# EAGLE design variator 380V (EAGLE 6.1)
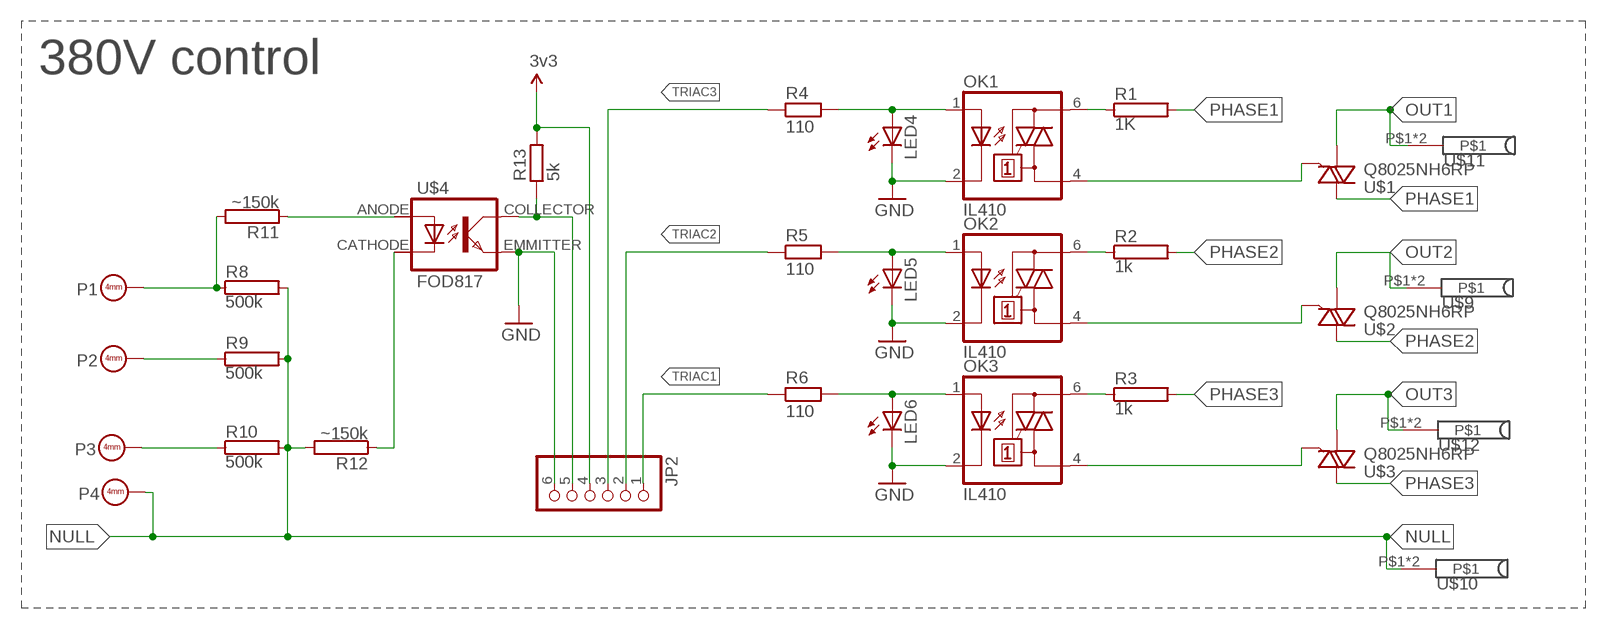
[diagram p0: schematic, sheet 1]

## Parts
JP2  PINHD-1X6/90  [1X06/90]
LED4  LED5MM  [LED5MM]
LED5  LED5MM  [LED5MM]
LED6  LED5MM  [LED5MM]
OK1  IL410  [DIL06]
OK2  IL410  [DIL06]
OK3  IL410  [DIL06]
P1  BANANA  [BANANA]
P2  BANANA  [BANANA]
P3  BANANA  [BANANA]
P4  BANANA  [BANANA]
R1  1K  RHPS58  [HPS58]
R2  1k  RHPS58  [HPS58]
R3  1k  RHPS58  [HPS58]
R4  110  R1206  [1206]
R5  110  R1206  [1206]
R6  110  R1206  [1206]
R8  500k  RAC01  [AC01]
R9  500k  RAC01  [AC01]
R10  500k  RAC01  [AC01]
R11  ~150k  RHPS58  [HPS58]
R12  ~150k  RHPS58  [HPS58]
R13  5k  R1206  [1206]
U$1  Q8025NH6RP  [TO-263]
U$2  Q8025NH6RP  [TO-263]
U$3  Q8025NH6RP  [TO-263]
U$4  FOD817  [FOD_4PIN]
U$9  BANANA  [BANANA]
U$10  BANANA  [BANANA]
U$11  BANANA  [BANANA]
U$12  BANANA  [BANANA]

## Nets
3V3: JP2.4 R13.2 ; supply symbol labelled 3v3
GND: JP2.6 LED4.K(C) LED5.K(C) LED6.K(C) OK1.2(C) OK2.2(C) OK3.2(C) U$4.EMMITTER(EMIT)
N$1: OK2.4(A1) U$2.G
N$2: OK1.4(A1) U$1.G
N$3: OK3.4(A1) U$3.G
N$4: OK1.6(A2) R1.1
N$5: OK2.6(A2) R2.1
N$6: OK3.6(A2) R3.1
N$7: LED4.A OK1.1(A) R4.2
N$10: LED5.A OK2.1(A) R5.2
N$11: LED6.A OK3.1(A) R6.2
N$14: R12.1 U$4.CATHODE
N$15: R11.1 U$4.ANODE
N$16: JP2.5 R13.1 U$4.COLLECTOR(COL)
NULL: P4.P$1 R8.2 R9.2 R10.2 R12.2 U$10.P$1 U$10.P$2
OUT1: U$1.T1 U$11.P$1 U$11.P$2
OUT2: U$2.T1 U$9.P$1 U$9.P$2
OUT3: U$3.T1 U$12.P$1 U$12.P$2
PHASE1: P1.P$1 R1.2 R8.1 R11.2 U$1.T2
PHASE2: P2.P$1 R2.2 R9.1 U$2.T2
PHASE3: P3.P$1 R3.2 R10.1 U$3.T2
TRIAC1: JP2.1 R6.1
TRIAC2: JP2.2 R5.1
TRIAC3: JP2.3 R4.1

## Notes on the sheet
- 380V control

## Library data of the parts
JP2 = pinhead:PINHD-1X6: PIN HEADER
LED4-LED6 = led:LED: LED OSRAM: - CHIPLED LG R971, LG N971, LY N971, LG Q971, LY Q971, LO R971, LY R971 LH N974, LH R974 LS Q976, LO Q976, LY Q976 LO Q996 - Hyper CHIPLED LW Q18S LB Q993, LB Q99A, LB R99A - SideLED LS A670, LO A670, LY A670, LG A670, LP A670 LB A673, LV A673, LT A673, LW A673 LH A674 LY A675 LS A676, LA A676, LO A676, LY A676, LW A676 LS A679, LY A679, LG A679 - Hyper Micro SIDELED® LS Y876, LA Y876, LO Y876, LY Y876 LT Y87S - SmartLED LW L88C, LW L88S LB L89C, LB L89S, LG L890 LS L89K, LO L89K, LY L89K LS L896, LA L896, LO L896, LY L896 - TOPLED LS T670, LO T670, LY T670, LG T670, LP T670 LSG T670, LSP T670, LSY T670, LOP T670, LYG T670 LG T671, LOG T671, LSG T671 LB T673, LV T673, LT T673, LW T673 LH T674 LS T676, LA T676, LO T676, LY T676, LB T676, LH T676, LSB T676, LW T676 LB T67C, LV T67C, LT T67C, LS T67K, LO T67K, LY T67K, LW E67C LS E67B, LA E67B, LO E67B, LY E67B, LB E67C, LV E67C, LT E67C LW T67C LS T679, LY T679, LG T679 LS T770, LO T770, LY T770, LG T770, LP T770 LB T773, LV T773, LT T773, LW T773 LH T774 LS E675, LA E675, LY E675, LS T675 LS T776, LA T776, LO T776, LY T776, LB T776 LHGB T686 LT T68C, LB T68C - Hyper Mini TOPLED® LB M676 - Mini TOPLED Santana® LG M470 LS M47K, LO M47K, LY M47K Source: http://www.osram.convergy.de LUXEON: - LUMILED® LXK2-PW12-R00, LXK2-PW12-S00, LXK2-PW14-U00, LXK2-PW14-V00 LXK2-PM12-R00, LXK2-PM12-S00, LXK2-PM14-U00 LXK2-PE12-Q00, LXK2-PE12-R00, LXK2-PE12-S00, LXK2-PE14-T00, LXK2-PE14-U00 LXK2-PB12-K00, LXK2-PB12-L00, LXK2-PB12-M00, LXK2-PB14-N00, LXK2-PB14-P00, LXK2-PB14-Q00 LXK2-PR12-L00, LXK2-PR12-M00, LXK2-PR14-Q00, LXK2-PR14-R00 LXK2-PD12-Q00, LXK2-PD12-R00, LXK2-PD12-S00 LXK2-PH12-R00, LXK2-PH12-S00 LXK2-PL12-P00, LXK2-PL12-Q00, LXK2-PL12-R00 Source: www.luxeon.com KINGBRIGHT: KA-3528ASYC Source: www.kingbright.com
OK1-OK3 = optocoupler:IL410: SIEMENS OPTO COUPLER; MF: VISHAY/TELEFUNKEN; MPN: IL410; OC_FARNELL: 1045434; OC_NEWARK: 58K1715
P1-P4 = adi_v1.4:BANANA
R1-R3 R8-R12 = resistor-power:R: Power Resitor; OC_FARNELL: unknown; OC_NEWARK: unknown
R4-R6 R13 = adi_v1.4:R
U$1-U$3 = Serghei IR station:Q8025NH6RP
U$4 = Serghei IR station:FOD817
U$9-U$12 = H_bridge_library:BANANA

## Board
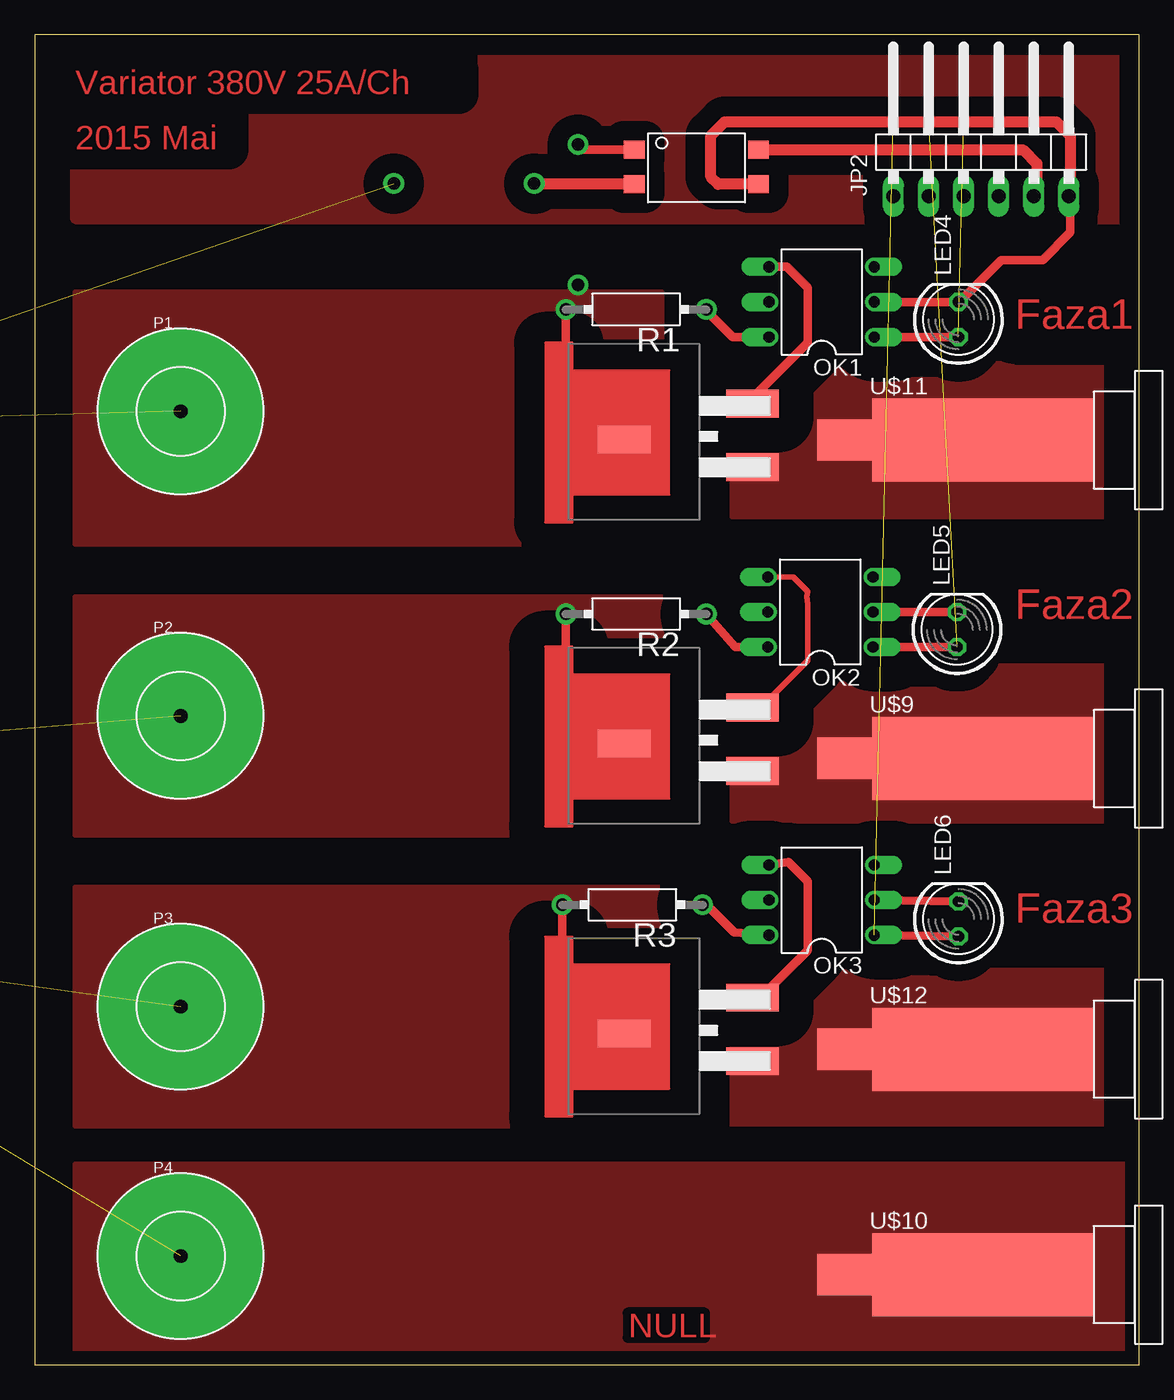
[diagram p1: board, top side]
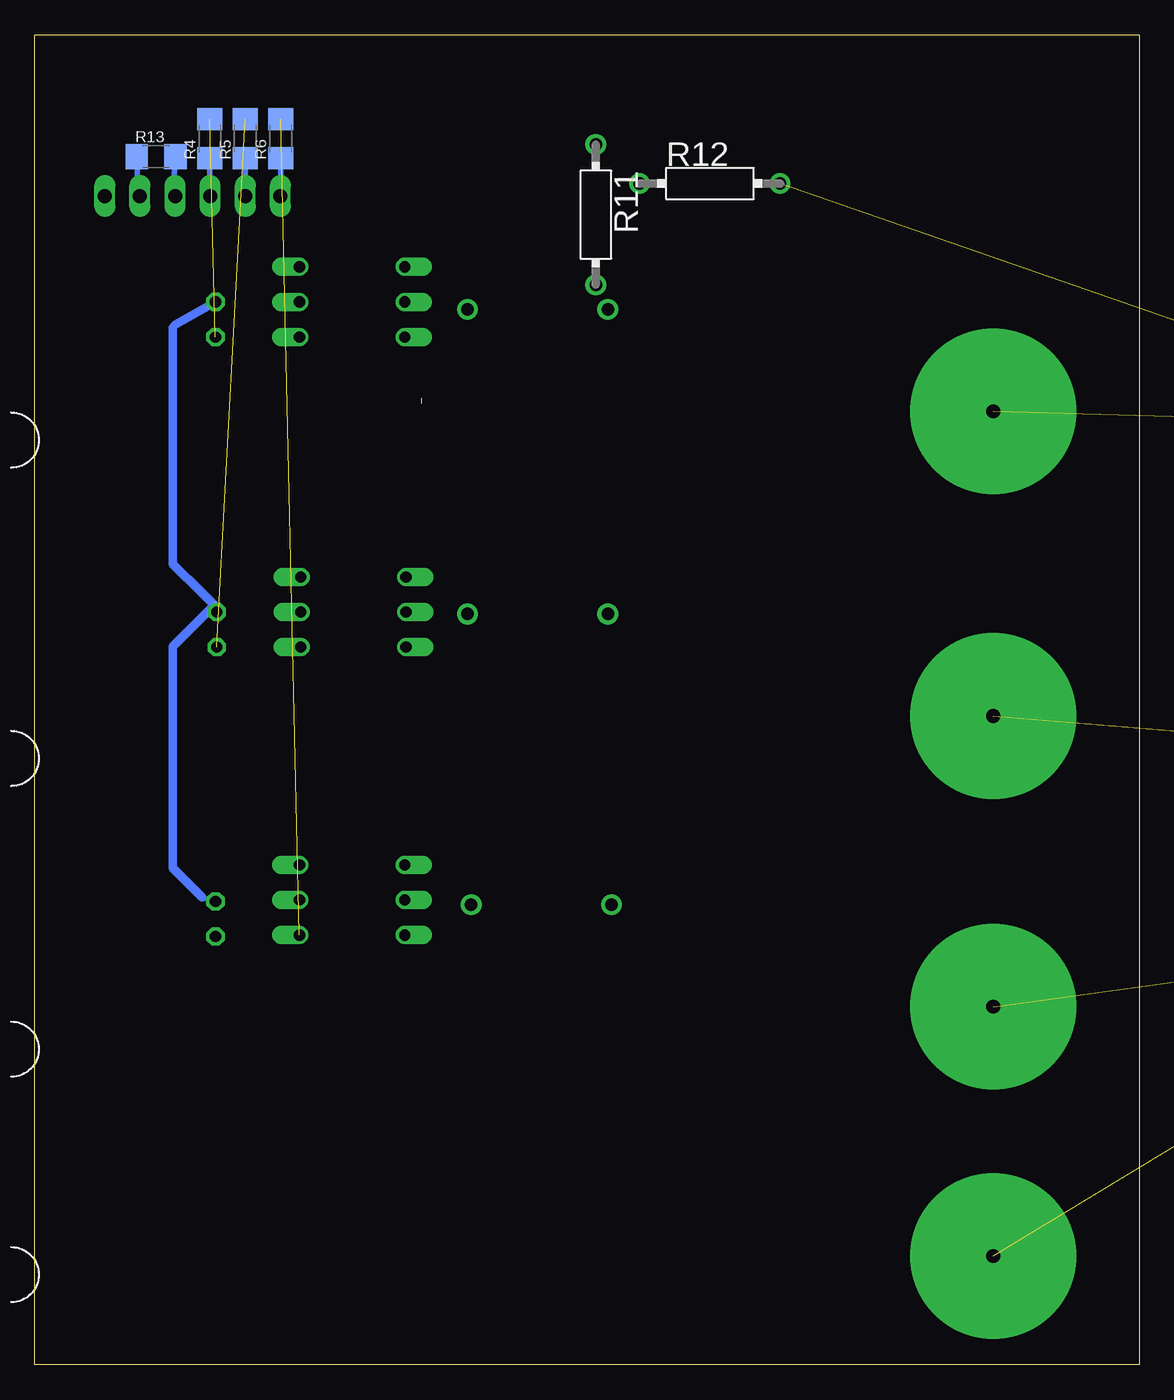
[diagram p2: board, bottom side, seen from below]

Size 79.95 x 96.32 mm. Coordinates in mm from the lower left corner, seen from the top.
Outline: 0,0 79.95,0 79.95,96.32 0,96.32 0,0
Copper layers (1*16): Top 0.035mm / dielectric 1.5mm / Bottom 0.035mm
Design rules: minimum track width 10mil, minimum drill 24mil, track to track 8mil, track to pad 8mil, pad to pad 8mil, via to via 8mil, smd to smd 8mil, copper to edge 40mil, drill to drill 8mil, minimum pad ring 10mil, minimum via ring 8mil, stop-mask expansion 4mil, vias tented up to drill 0mil, thermal gap 10mil

### Footprints (pad centres in the part's own frame; a part is rotated, then mirrored left to right if it is on the bottom)
1X06/90 = drill 1.016 long: 1 -6.35,-3.81; 2 -3.81,-3.81; 3 -1.27,-3.81; 4 1.27,-3.81; 5 3.81,-3.81; 6 6.35,-3.81
LED5MM = drill 0.813 octagon: A -1.27,0; K 1.27,0
DIL06 = drill 0.813 offset: 1 -2.54,-3.81; 2 0,-3.81; 3 2.54,-3.81; 4 2.54,3.81; 5 0,3.81; 6 -2.54,3.81
BANANA = drill 1 pad 12: P$1 0,0
HPS58 = drill 0.9 pad 1.5: 1 -5.08,0; 2 5.08,0
1206 = smd 1.6 x 1.8: 1 -1.4,0; 2 1.4,0
AC01 = drill 1.1 pad 2: 1 -8.9,0; 2 8.9,0
TO-263 = smd 2 x 3.81: G 4.6,0; T1 0,0; T2 2,9.27
FOD_4PIN = smd 1.3 x 1.5: ANODE 2.5,9; CATHODE 0,9; COLLECTOR 2.5,0; EMMITTER 0,0
BANANA' = smd 16 x 6: P$1 0.84,-0.08 | smd 4 x 3: P$2 -9.16,-0.08

### Placement (x,y rotation side)
JP2  68.51,88.44 0 top
LED4  66.86,75.69 90 top
LED5  66.76,53.24 90 top
LED6  66.86,32.29 90 top
OK1  56.97,76.96 90 top
OK2  56.87,54.51 90 top
OK3  56.97,33.66 90 top
P1  10.57,69.04 0 top
P2  10.57,46.99 0 top
P3  10.57,25.94 0 top
P4  10.57,7.89 0 top
R1  43.54,76.42 180 top
R2  43.54,54.37 180 top
R3  43.27,33.32 180 top
R4  67.26,88.78 90 bottom
R5  64.7,88.78 90 bottom
R6  62.14,88.78 90 bottom
R8  -13.83,68.62 180 top  (outside the outline)
R9  -13.83,45.7 180 top  (outside the outline)
R10  -13.83,28.05 180 top  (outside the outline)
R11  39.33,83.28 270 bottom
R12  31.08,85.53 0 bottom
R13  71.15,87.48 0 bottom
U$1  51.95,65 90 top
U$2  51.95,43 90 top
U$3  51.95,22 90 top
U$4  52.4,85.47 90 top
U$9  BANANA  [BANANA']  67.8,43.99 0 top
U$10  BANANA  [BANANA']  67.8,6.62 0 top
U$11  BANANA  [BANANA']  67.8,67.04 0 top
U$12  BANANA  [BANANA']  67.8,22.94 0 top

### Tracks (layer width: path | path; a pad name or v marks a point on that pad's centre or on a via)
3V3  (via drill 0.6)
  Top 0.406: JP2.4 v69.91,84.63
  Bottom 0.406: v69.91,84.63 R13.2
GND
  Top 0.406: 74.86,83.36 JP2.6 74.95,84.54 | LED4.K 66.91,76.96
  Top 0.61: LED6.K OK3.2 | LED4.K OK1.2 | 66.91,76.96 69.95,80 72.95,80 74.95,82 74.95,84.54 | LED5.K OK2.2
  Top 0.813: U$4.EMMITTER 49.48,85.47 48.95,86 48.95,89 49.95,90 73.95,90 74.95,89 74.95,84.72 JP2.6
  Bottom 0.406: LED6.K 67.81,33.86 | 66.95,55 LED5.K 67.86,55.91
  Bottom 0.61: 67.81,33.86 69.95,36 69.95,52 66.95,55 67.86,55.91 69.95,58 69.95,73.87 69.95,74 69.95,75.1 69.75,75.3 LED4.K
N$1
  Top 0.406: OK2.4 54.9,57.05 55.95,56 55.9,55.65 55.95,55.1 55.95,51 52.95,48 52.35,48 U$2.G
N$2  (1 unrouted)
  Top 0.61: OK1.4 54.45,79.5 55.95,78 55.95,74 51.95,70
N$3
  Top 0.406: U$3.G 51.95,26
  Top 0.61: OK3.4 54.55,36.4 55.95,35 55.95,30 51.95,26
N$4
  Top 0.406: 48.95,76 48.95,76.09 R1.1
  Top 0.61: OK1.6 50.53,74.42 48.95,76
N$5
  Top 0.61: OK2.6 50.72,51.97 R2.1
N$6
  Top 0.406: 48.95,33 48.85,33 48.45,33.4 48.35,33.4 48.27,33.32 | R3.1 48.27,33.32 | 48.27,33.32 47.95,33
  Top 0.61: OK3.6 50.63,31.32 48.95,33
N$7  (1 unrouted)
  Top 0.61: LED4.A OK1.1
N$10  (1 unrouted)
  Top 0.61: LED5.A OK2.1
N$11  (1 unrouted)
  Top 0.61: LED6.A OK3.1
N$14
  Top 0.813: R12.1 43.34,85.53 U$4.CATHODE
N$15
  Top 0.61: U$4.ANODE 42.98,87.97 42.95,88 39.69,88 R11.1
N$16  (via drill 0.6)
  Top 0.406: v72.45,84.5 JP2.5
  Top 0.813: U$4.COLLECTOR 71.54,87.97 72.53,86.98 72.53,84.84 JP2.5
  Bottom 0.406: R13.1 v72.45,84.5
NONE
  pour Top (isolate 1.422): 2.95,95 2.95,83 79.95,83 79.95,95
NULL  (4 unrouted)
  pour Top (isolate 0.406, no thermals): 2.95,0 2.95,14.51 79.69,14.51 79.69,0
OUT1
  pour Top (isolate 2.54, no thermals): 50.48,72.66 50.48,61.42 79.69,61.42 79.69,72.66
OUT2
  pour Top (isolate 2.54, no thermals): 50.48,39.37 79.69,39.37 79.69,50.61 50.48,50.61
OUT3
  pour Top (isolate 2.54, rank 2, no thermals): 50.48,28.56 50.48,17.32 79.69,17.32 79.69,28.56
PHASE1  (1 unrouted)
  Top 0.406: 38.46,71.49 42.95,67
  Top 0.61: R1.2 38.46,71.49
  pour Top (isolate 2.184, no thermals): 45.4,77.66 2.95,77.66 2.95,59.42 45.4,59.42
PHASE2  (1 unrouted)
  Top 0.406: 38.46,49.22 U$2.T2
  Top 0.61: R2.2 38.46,49.22
  pour Top (isolate 2.54, no thermals): 2.95,55.61 2.95,38.37 45.4,38.37 45.4,55.61
PHASE3  (1 unrouted)
  Top 0.406: 38.19,28.49 U$3.T2
  Top 0.61: R3.2 38.19,28.49
  pour Top (isolate 2.54, no thermals): 2.95,34.56 2.95,17.32 45.4,17.32 45.4,34.56
TRIAC1
  Bottom 0.406: R6.1 JP2.1
TRIAC2
  Bottom 0.406: R5.1 JP2.2
TRIAC3
  Bottom 0.406: R4.1 JP2.3

### Text on the board
Top: Variator 380V 25A/Ch | 2015 Mai | Faza1 | Faza2 | Faza3 | NULL